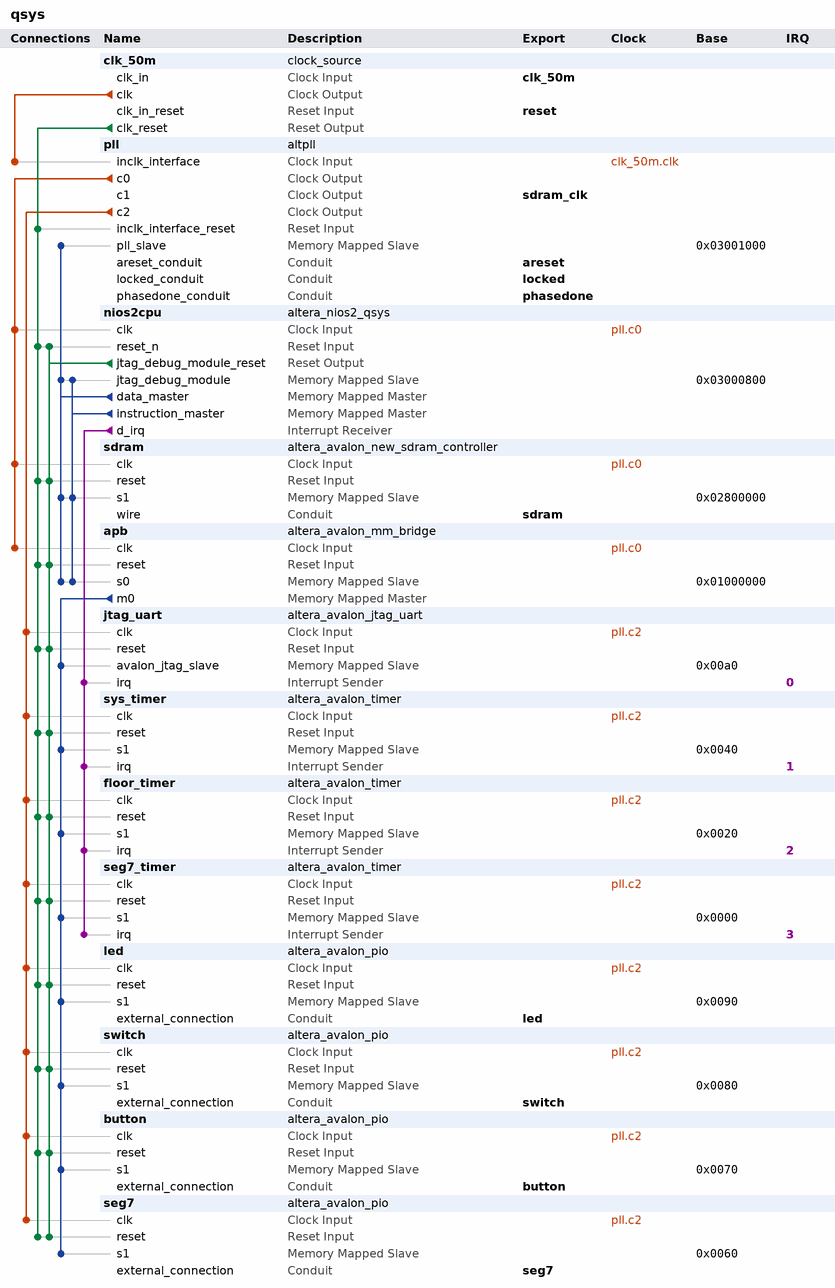
[diagram p0: system contents]
# Platform Designer (Qsys) system qsys, Cyclone III EP3C16F484C6
# Parameters at their usual value, and those the tool derives, are not listed.
package require -exact qsys 13.0.1.99.2
create_system qsys
set_project_property DEVICE_FAMILY {Cyclone III}
set_project_property DEVICE EP3C16F484C6

add_instance clk_50m clock_source 13.0
set_instance_parameter_value clk_50m clockFrequency 50000000

add_instance pll altpll 13.0
set_instance_parameter_value pll INCLK0_INPUT_FREQUENCY 20000
set_instance_parameter_value pll CLK0_MULTIPLY_BY 8
set_instance_parameter_value pll CLK1_MULTIPLY_BY 8
set_instance_parameter_value pll CLK2_MULTIPLY_BY 1
set_instance_parameter_value pll CLK0_DIVIDE_BY 3
set_instance_parameter_value pll CLK1_DIVIDE_BY 3
set_instance_parameter_value pll CLK2_DIVIDE_BY 5
set_instance_parameter_value pll CLK1_PHASE_SHIFT -1875
set_instance_parameter_value pll CLK2_PHASE_SHIFT 0
set_instance_parameter_value pll CLK1_DUTY_CYCLE 50
set_instance_parameter_value pll CLK2_DUTY_CYCLE 50
set_instance_parameter_value pll PORT_clk1 PORT_USED
set_instance_parameter_value pll PORT_clk2 PORT_USED
set_instance_parameter_value pll PORT_clk3 PORT_UNUSED
set_instance_parameter_value pll PORT_ARESET PORT_UNUSED
set_instance_parameter_value pll PORT_LOCKED PORT_UNUSED

add_instance nios2cpu altera_nios2_qsys 13.0
set_instance_parameter_value nios2cpu resetSlave sdram.s1
set_instance_parameter_value nios2cpu mmu_TLBMissExcSlave None
set_instance_parameter_value nios2cpu exceptionSlave sdram.s1
set_instance_parameter_value nios2cpu breakSlave nios2cpu.jtag_debug_module
set_instance_parameter_value nios2cpu impl Tiny
set_instance_parameter_value nios2cpu icache_size 4096

add_instance sdram altera_avalon_new_sdram_controller 13.0.1.99.2
set_instance_parameter_value sdram TAC 5.5
set_instance_parameter_value sdram TRCD 20.0
set_instance_parameter_value sdram TRP 20.0
set_instance_parameter_value sdram casLatency 3
set_instance_parameter_value sdram columnWidth 8
set_instance_parameter_value sdram dataWidth 16
set_instance_parameter_value sdram generateSimulationModel false
set_instance_parameter_value sdram model single_Micron_MT48LC4M32B2_7_chip
set_instance_parameter_value sdram numberOfBanks 4
set_instance_parameter_value sdram numberOfChipSelects 1
set_instance_parameter_value sdram powerUpDelay 200.0
set_instance_parameter_value sdram refreshPeriod 7.8125
set_instance_parameter_value sdram rowWidth 12

add_instance apb altera_avalon_mm_bridge 13.0
set_instance_parameter_value apb DATA_WIDTH 32
set_instance_parameter_value apb ADDRESS_WIDTH 10
set_instance_parameter_value apb ADDRESS_UNITS SYMBOLS
set_instance_parameter_value apb MAX_PENDING_RESPONSES 4

add_instance jtag_uart altera_avalon_jtag_uart 13.0.1.99.2
set_instance_parameter_value jtag_uart simInteractiveOptions NO_INTERACTIVE_WINDOWS

add_instance sys_timer altera_avalon_timer 13.0.1.99.2
set_instance_parameter_value sys_timer period 1
set_instance_parameter_value sys_timer periodUnits USEC

add_instance floor_timer altera_avalon_timer 13.0.1.99.2
set_instance_parameter_value floor_timer period 1
set_instance_parameter_value floor_timer periodUnits USEC

add_instance seg7_timer altera_avalon_timer 13.0.1.99.2
set_instance_parameter_value seg7_timer period 1
set_instance_parameter_value seg7_timer periodUnits USEC

add_instance led altera_avalon_pio 13.0.1.99.2
set_instance_parameter_value led direction Output
set_instance_parameter_value led width 10

add_instance switch altera_avalon_pio 13.0.1.99.2
set_instance_parameter_value switch direction Input
set_instance_parameter_value switch width 6

add_instance button altera_avalon_pio 13.0.1.99.2
set_instance_parameter_value button captureEdge true
set_instance_parameter_value button direction Input
set_instance_parameter_value button edgeType FALLING
set_instance_parameter_value button width 2

add_instance seg7 altera_avalon_pio 13.0.1.99.2
set_instance_parameter_value seg7 direction Output
set_instance_parameter_value seg7 width 16

# connections
add_connection clk_50m.clk pll.inclk_interface clock
add_connection pll.c0 apb.clk clock
add_connection pll.c0 nios2cpu.clk clock
add_connection pll.c0 sdram.clk clock
add_connection pll.c2 button.clk clock
add_connection pll.c2 floor_timer.clk clock
add_connection pll.c2 jtag_uart.clk clock
add_connection pll.c2 led.clk clock
add_connection pll.c2 seg7.clk clock
add_connection pll.c2 seg7_timer.clk clock
add_connection pll.c2 switch.clk clock
add_connection pll.c2 sys_timer.clk clock
add_connection clk_50m.clk_reset apb.reset reset
add_connection clk_50m.clk_reset button.reset reset
add_connection clk_50m.clk_reset floor_timer.reset reset
add_connection clk_50m.clk_reset jtag_uart.reset reset
add_connection clk_50m.clk_reset led.reset reset
add_connection clk_50m.clk_reset nios2cpu.reset_n reset
add_connection clk_50m.clk_reset pll.inclk_interface_reset reset
add_connection clk_50m.clk_reset sdram.reset reset
add_connection clk_50m.clk_reset seg7.reset reset
add_connection clk_50m.clk_reset seg7_timer.reset reset
add_connection clk_50m.clk_reset switch.reset reset
add_connection clk_50m.clk_reset sys_timer.reset reset
add_connection nios2cpu.jtag_debug_module_reset apb.reset reset
add_connection nios2cpu.jtag_debug_module_reset button.reset reset
add_connection nios2cpu.jtag_debug_module_reset floor_timer.reset reset
add_connection nios2cpu.jtag_debug_module_reset jtag_uart.reset reset
add_connection nios2cpu.jtag_debug_module_reset led.reset reset
add_connection nios2cpu.jtag_debug_module_reset nios2cpu.reset_n reset
add_connection nios2cpu.jtag_debug_module_reset sdram.reset reset
add_connection nios2cpu.jtag_debug_module_reset seg7.reset reset
add_connection nios2cpu.jtag_debug_module_reset seg7_timer.reset reset
add_connection nios2cpu.jtag_debug_module_reset switch.reset reset
add_connection nios2cpu.jtag_debug_module_reset sys_timer.reset reset
add_connection apb.m0 button.s1 avalon
set_connection_parameter_value apb.m0/button.s1 baseAddress 0x0070
add_connection apb.m0 floor_timer.s1 avalon
set_connection_parameter_value apb.m0/floor_timer.s1 baseAddress 0x0020
add_connection apb.m0 jtag_uart.avalon_jtag_slave avalon
set_connection_parameter_value apb.m0/jtag_uart.avalon_jtag_slave baseAddress 0x00a0
add_connection apb.m0 led.s1 avalon
set_connection_parameter_value apb.m0/led.s1 baseAddress 0x0090
add_connection apb.m0 seg7.s1 avalon
set_connection_parameter_value apb.m0/seg7.s1 baseAddress 0x0060
add_connection apb.m0 seg7_timer.s1 avalon
set_connection_parameter_value apb.m0/seg7_timer.s1 baseAddress 0x0000
add_connection apb.m0 switch.s1 avalon
set_connection_parameter_value apb.m0/switch.s1 baseAddress 0x0080
add_connection apb.m0 sys_timer.s1 avalon
set_connection_parameter_value apb.m0/sys_timer.s1 baseAddress 0x0040
add_connection nios2cpu.data_master apb.s0 avalon
set_connection_parameter_value nios2cpu.data_master/apb.s0 baseAddress 0x01000000
add_connection nios2cpu.data_master nios2cpu.jtag_debug_module avalon
set_connection_parameter_value nios2cpu.data_master/nios2cpu.jtag_debug_module baseAddress 0x03000800
add_connection nios2cpu.data_master pll.pll_slave avalon
set_connection_parameter_value nios2cpu.data_master/pll.pll_slave baseAddress 0x03001000
add_connection nios2cpu.data_master sdram.s1 avalon
set_connection_parameter_value nios2cpu.data_master/sdram.s1 baseAddress 0x02800000
add_connection nios2cpu.instruction_master apb.s0 avalon
set_connection_parameter_value nios2cpu.instruction_master/apb.s0 baseAddress 0x01000000
add_connection nios2cpu.instruction_master nios2cpu.jtag_debug_module avalon
set_connection_parameter_value nios2cpu.instruction_master/nios2cpu.jtag_debug_module baseAddress 0x03000800
add_connection nios2cpu.instruction_master sdram.s1 avalon
set_connection_parameter_value nios2cpu.instruction_master/sdram.s1 baseAddress 0x02800000
add_connection nios2cpu.d_irq floor_timer.irq interrupt
set_connection_parameter_value nios2cpu.d_irq/floor_timer.irq irqNumber 2
add_connection nios2cpu.d_irq jtag_uart.irq interrupt
set_connection_parameter_value nios2cpu.d_irq/jtag_uart.irq irqNumber 0
add_connection nios2cpu.d_irq seg7_timer.irq interrupt
set_connection_parameter_value nios2cpu.d_irq/seg7_timer.irq irqNumber 3
add_connection nios2cpu.d_irq sys_timer.irq interrupt
set_connection_parameter_value nios2cpu.d_irq/sys_timer.irq irqNumber 1

# exported interfaces
add_interface clk_50m clock sink
set_interface_property clk_50m EXPORT_OF clk_50m.clk_in
add_interface reset reset sink
set_interface_property reset EXPORT_OF clk_50m.clk_in_reset
add_interface areset conduit end
set_interface_property areset EXPORT_OF pll.areset_conduit
add_interface locked conduit end
set_interface_property locked EXPORT_OF pll.locked_conduit
add_interface phasedone conduit end
set_interface_property phasedone EXPORT_OF pll.phasedone_conduit
add_interface sdram conduit end
set_interface_property sdram EXPORT_OF sdram.wire
add_interface sdram_clk clock source
set_interface_property sdram_clk EXPORT_OF pll.c1
add_interface led conduit end
set_interface_property led EXPORT_OF led.external_connection
add_interface switch conduit end
set_interface_property switch EXPORT_OF switch.external_connection
add_interface button conduit end
set_interface_property button EXPORT_OF button.external_connection
add_interface seg7 conduit end
set_interface_property seg7 EXPORT_OF seg7.external_connection

set_interconnect_requirement {$system} qsys_mm.clockCrossingAdapter HANDSHAKE
set_interconnect_requirement {$system} qsys_mm.maxAdditionalLatency 1
set_interconnect_requirement {$system} qsys_mm.insertDefaultSlave false

save_system qsys.qsys
